# EAGLE design arpie_cv_tab (EAGLE 6.6.0)
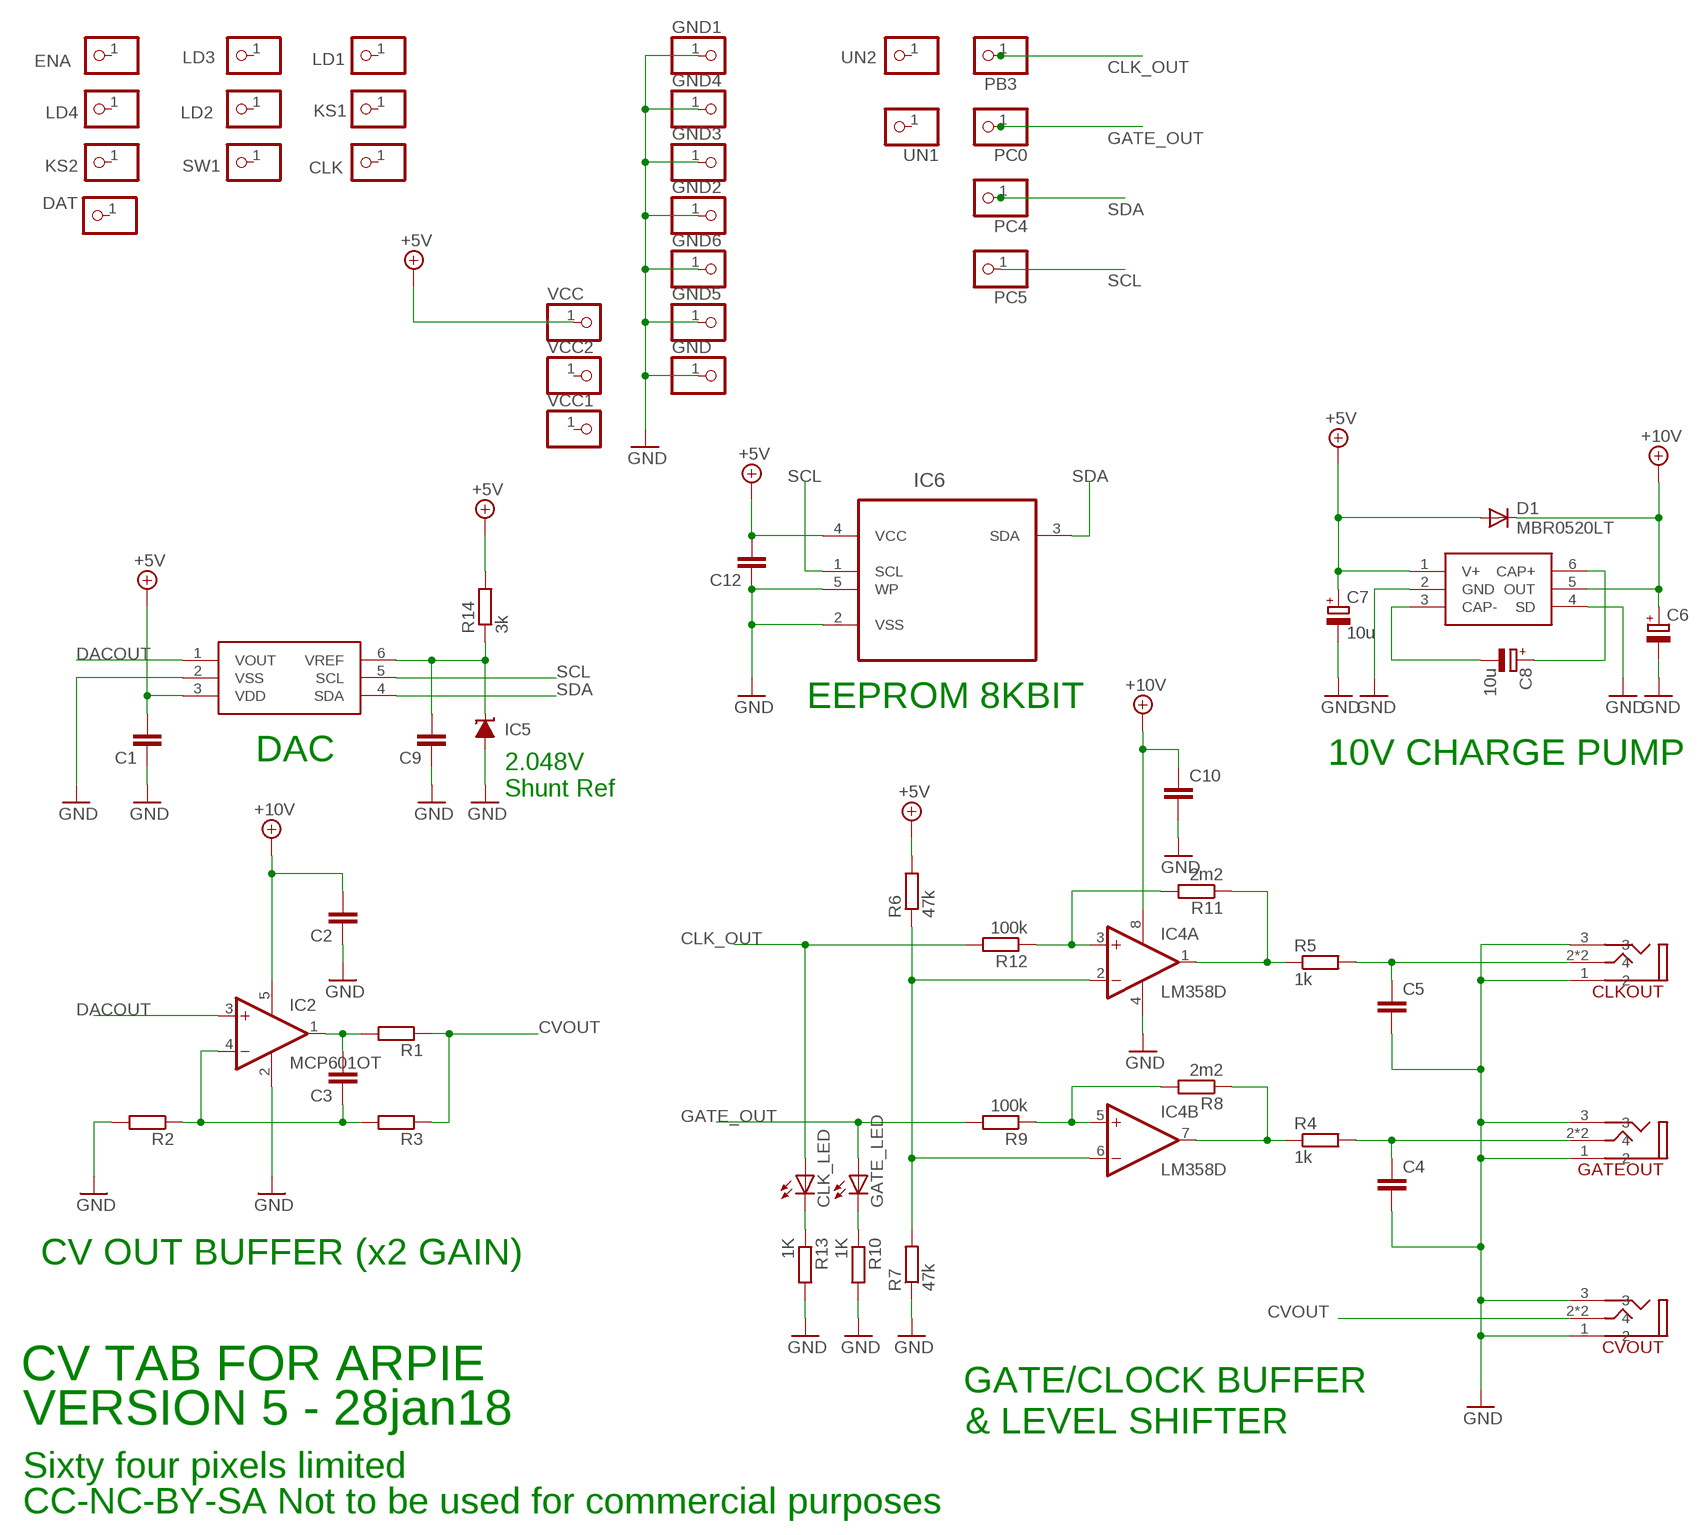
[diagram p0: schematic, sheet 1]

## Parts
C1  C-EUC0805  [C0805]
C2  C-EUC0805  [C0805]
C3  C-EUC0805  [C0805]
C4  C-EUC0805  [C0805]
C5  C-EUC0805  [C0805]
C6  CPOL-EUSMCA  [SMC_A]
C7  10u  CPOL-EUSMCA  [SMC_A]
C8  10u  CPOL-EUSMCA  [SMC_A]
C9  C-EUC0805  [C0805]
C10  C-EUC0805  [C0805]
C12  C-EUC0805  [C0805]
CLK  PINHD-1X1  [1X01]
CLK_LED  LEDCHIP-LED0805  [CHIP-LED0805]
CLKOUT  3_5MM_PTH_MICRO  [3_5MM_PTH_MICRO]
CVOUT  3_5MM_PTH_MICRO  [3_5MM_PTH_MICRO]
D1  MBR0520LT  [SOD123]
DAT  PINHD-1X1  [1X01]
ENA  PINHD-1X1  [1X01]
GATE_LED  LEDCHIP-LED0805  [CHIP-LED0805]
GATEOUT  3_5MM_PTH_MICRO  [3_5MM_PTH_MICRO]
GND  PINHD-1X1  [1X01]
GND1  PINHD-1X1  [1X01]
GND2  PINHD-1X1  [1X01]
GND3  PINHD-1X1  [1X01]
GND4  PINHD-1X1  [1X01]
GND5  PINHD-1X1  [1X01]
GND6  PINHD-1X1  [1X01]
IC1  MCP4726  [SOT23-6]
IC2  MCP601OT  [SOT23-5]
IC3  LM27675M5_CHARGEPUMP  [SOT23-6]
IC4  LM358D  [SO08]
IC5  LM4041A12DBZ  [DBZ_R-PDSO-G3]
IC6  24LC_16BT-I/OT  [SOT95P290X145-5N]
KS1  PINHD-1X1  [1X01]
KS2  PINHD-1X1  [1X01]
LD1  PINHD-1X1  [1X01]
LD2  PINHD-1X1  [1X01]
LD3  PINHD-1X1  [1X01]
LD4  PINHD-1X1  [1X01]
PB3  PINHD-1X1  [1X01]
PC0  PINHD-1X1  [1X01]
PC4  PINHD-1X1  [1X01]
PC5  PINHD-1X1  [1X01]
R1  R-EU_R0805  [R0805]
R2  R-EU_R0805  [R0805]
R3  R-EU_R0805  [R0805]
R4  1k  R-EU_R0805  [R0805]
R5  1k  R-EU_R0805  [R0805]
R6  47k  R-EU_R0805  [R0805]
R7  47k  R-EU_R0805  [R0805]
R8  2m2  R-EU_R0805  [R0805]
R9  100k  R-EU_R0805  [R0805]
R10  1K  R-EU_R0805  [R0805]
R11  2m2  R-EU_R0805  [R0805]
R12  100k  R-EU_R0805  [R0805]
R13  1K  R-EU_R0805  [R0805]
R14  3k  R-EU_R0805  [R0805]
SW1  PINHD-1X1  [1X01]
UN1  PINHD-1X1  [1X01]
UN2  PINHD-1X1  [1X01]
VCC  PINHD-1X1  [1X01]
VCC1  PINHD-1X1  [1X01]
VCC2  PINHD-1X1  [1X01]

## Nets
+5V: C1.2 C7.+ C12.2 D1.A IC1.3(VDD) IC3.1(V+) IC6.4(VCC) R6.2 R14.2 VCC.1
+10V: C2.2 C6.+ C10.1 D1.C IC2.5(V+) IC3.5(OUT) IC4.8(P:V+)
CLK_OUT: CLK_LED.A PB3.1 R12.2
CVOUT: CVOUT.2 CVOUT.2A R1.1 R3.1
DACOUT: IC1.1(VOUT) IC2.3(+IN)
GATE_OUT: GATE_LED.A PC0.1 R9.2
GND: C1.1 C2.1 C4.2 C5.2 C6.- C7.- C9.1 C10.2 C12.1 CLKOUT.1 CLKOUT.3 CVOUT.1 CVOUT.3 GATEOUT.1 GATEOUT.3 GND1.1 GND2.1 GND3.1 GND4.1 GND5.1 GND6.1 GND.1 IC1.2(VSS) IC2.2(V-) IC3.2(GND) IC3.4(SD) IC4.4(P:V-) IC5.2(A) IC6.2(VSS) IC6.5(WP) R2.2 R7.1 R10.2 R13.2
N$1: IC4.2(A:-IN) IC4.6(B:-IN) R6.1 R7.2
N$2: CLK_LED.C R13.1
N$3: GATE_LED.C R10.1
N$4: IC4.3(A:+IN) R11.2 R12.1
N$5: IC4.5(B:+IN) R8.2 R9.1
N$6: C9.2 IC1.6(VREF) IC5.1(C) R14.1
N$9: IC4.1(A:OUT) R5.1 R11.1
N$11: C3.2 IC2.1(OUT) R1.2
N$12: IC4.7(B:OUT) R4.1 R8.1
N$15: C3.1 IC2.4(-IN) R2.1 R3.2
N$19: C5.1 CLKOUT.2 CLKOUT.2A R5.2
N$20: C4.1 GATEOUT.2 GATEOUT.2A R4.2
N$38: C8.+ IC3.6(CAP+)
N$39: C8.- IC3.3(CAP-)
SCL: IC1.5(SCL) IC6.1(SCL) PC5.1
SDA: IC1.4(SDA) IC6.3(SDA) PC4.1
Unconnected: CLK.1 DAT.1 ENA.1 KS1.1 KS2.1 LD1.1 LD2.1 LD3.1 LD4.1 SW1.1 UN1.1 UN2.1 VCC1.1 VCC2.1

## Notes on the sheet
- EEPROM 8KBIT
- DAC | 10V CHARGE PUMP
- 2.048V 
  Shunt Ref
- CV OUT BUFFER (x2 GAIN)
- CV TAB FOR ARPIE
- GATE/CLOCK BUFFER
- VERSION 5 - 28jan18 | & LEVEL SHIFTER
- Sixty four pixels limited
- CC-NC-BY-SA Not to be used for commercial purposes

## Library data of the parts
C1-C5 C9 C10 C12 = resistor:C-EU: CAPACITOR, European symbol
C6-C8 = rcl:CPOL-EU: POLARIZED CAPACITOR, European symbol
CLK DAT ENA GND GND1-GND6 KS1 KS2 LD1-LD4 PB3 PC0 PC4 PC5 SW1 UN1 UN2 VCC VCC1 VCC2 = adafruit:PINHD-1X1: Pin header 1x1 for 0.1" spacing With round pins
CLK_LED GATE_LED = led:LED: LED OSRAM: - CHIPLED LG R971, LG N971, LY N971, LG Q971, LY Q971, LO R971, LY R971 LH N974, LH R974 LS Q976, LO Q976, LY Q976 LO Q996 - Hyper CHIPLED LW Q18S LB Q993, LB Q99A, LB R99A - SideLED LS A670, LO A670, LY A670, LG A670, LP A670 LB A673, LV A673, LT A673, LW A673 LH A674 LY A675 LS A676, LA A676, LO A676, LY A676, LW A676 LS A679, LY A679, LG A679 - Hyper Micro SIDELED® LS Y876, LA Y876, LO Y876, LY Y876 LT Y87S - SmartLED LW L88C, LW L88S LB L89C, LB L89S, LG L890 LS L89K, LO L89K, LY L89K LS L896, LA L896, LO L896, LY L896 - TOPLED LS T670, LO T670, LY T670, LG T670, LP T670 LSG T670, LSP T670, LSY T670, LOP T670, LYG T670 LG T671, LOG T671, LSG T671 LB T673, LV T673, LT T673, LW T673 LH T674 LS T676, LA T676, LO T676, LY T676, LB T676, LH T676, LSB T676, LW T676 LB T67C, LV T67C, LT T67C, LS T67K, LO T67K, LY T67K, LW E67C LS E67B, LA E67B, LO E67B, LY E67B, LB E67C, LV E67C, LT E67C LW T67C LS T679, LY T679, LG T679 LS T770, LO T770, LY T770, LG T770, LP T770 LB T773, LV T773, LT T773, LW T773 LH T774 LS E675, LA E675, LY E675, LS T675 LS T776, LA T776, LO T776, LY T776, LB T776 LHGB T686 LT T68C, LB T68C - Hyper Mini TOPLED® LB M676 - Mini TOPLED Santana® LG M470 LS M47K, LO M47K, LY M47K Source: http://www.osram.convergy.de LUXEON: - LUMILED® LXK2-PW12-R00, LXK2-PW12-S00, LXK2-PW14-U00, LXK2-PW14-V00 LXK2-PM12-R00, LXK2-PM12-S00, LXK2-PM14-U00 LXK2-PE12-Q00, LXK2-PE12-R00, LXK2-PE12-S00, LXK2-PE14-T00, LXK2-PE14-U00 LXK2-PB12-K00, LXK2-PB12-L00, LXK2-PB12-M00, LXK2-PB14-N00, LXK2-PB14-P00, LXK2-PB14-Q00 LXK2-PR12-L00, LXK2-PR12-M00, LXK2-PR14-Q00, LXK2-PR14-R00 LXK2-PD12-Q00, LXK2-PD12-R00, LXK2-PD12-S00 LXK2-PH12-R00, LXK2-PH12-S00 LXK2-PL12-P00, LXK2-PL12-Q00, LXK2-PL12-R00 Source: www.luxeon.com KINGBRIGHT: KA-3528ASYC Source: www.kingbright.com
CLKOUT CVOUT GATEOUT = jason_eagle6:3_5MM_PTH_MICRO
D1 = diode:MBR0520LT: SCHOTTKY BARRIER RECTIFIER Source: http://onsemi.com .. MBR0520LT1-D.pdf
IC1 = jasons_stuff:MCP4726: I2C DAC 12BIT
IC2 = linear:MCP601: Single Op Amp 2.7V to 6.0V Single Supply CMOS Source: http://ww1.microchip.com/downloads/en/DeviceDoc/21314g.pdf
IC3 = jason_eagle6:LM27675M5_CHARGEPUMP
IC4 = linear:LM358: OP AMP also LM158; LM258; LM2904 Source: http://cache.national.com/ds/LM/LM158.pdf
IC5 = texas:LM4041: PRECISION MICROPOWER SHUNT VOLTAGE REFERENCE Source: http://focus.ti.com/lit/ds/slcs146e/slcs146e.pdf; MPN: LM4041A12IDBZR; OC_FARNELL: 1407949; OC_NEWARK: 58K5875
IC6 = Microchip-24LCxxx:24LC_: IC, I2C Serial EEPROM,SOT-23-5; MPN: 24LC16BT-I/OT; OC_FARNELL: 9757961; OC_NEWARK: 62K0580; PACKAGE: SOT-23-5; SUPPLIER: MICROCHIP
R1-R14 = rcl:R-EU_: RESISTOR, European symbol

## Board
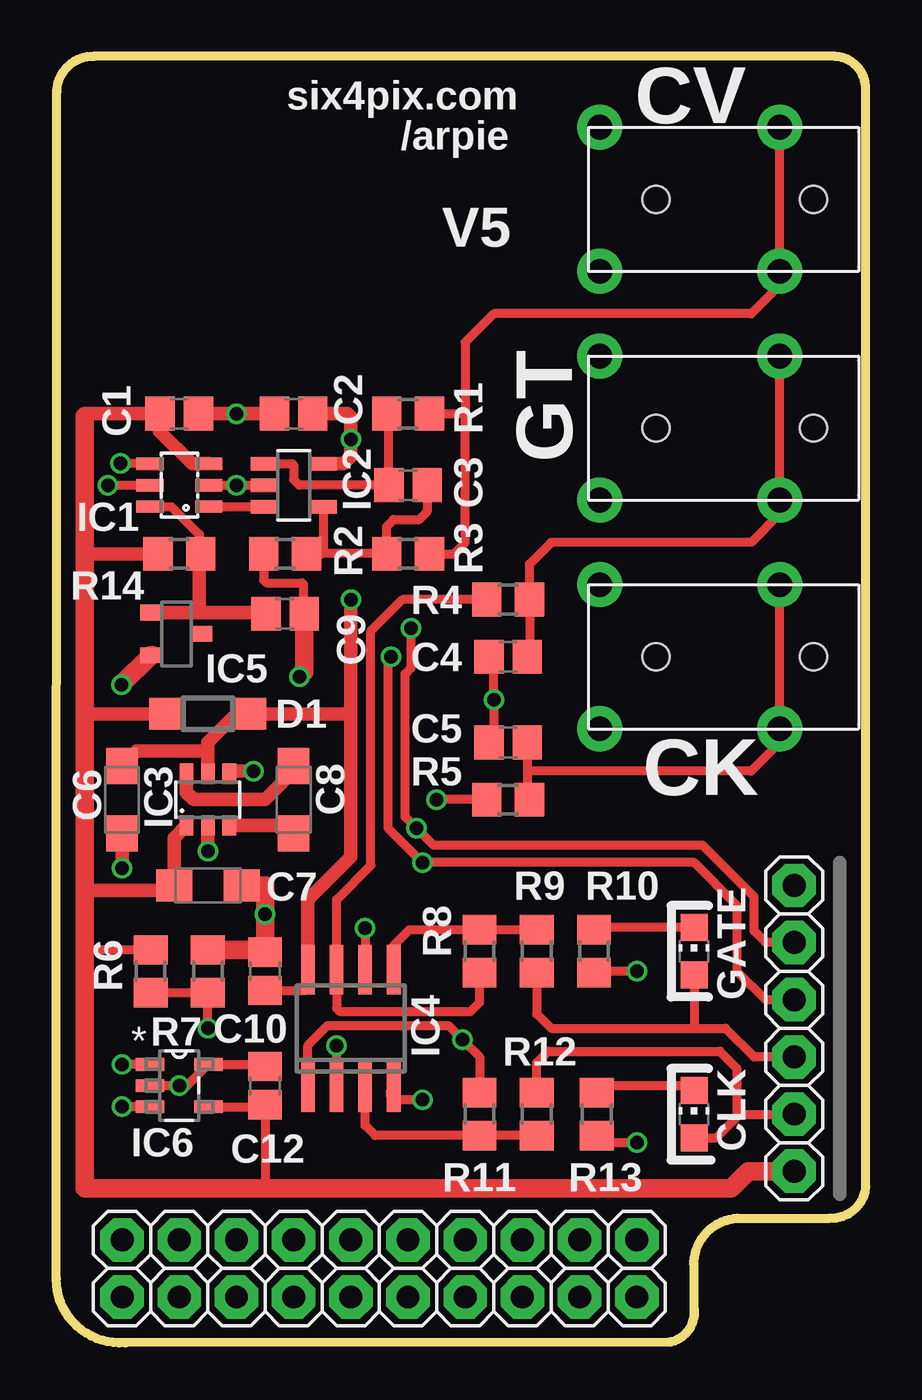
[diagram p1: board, top side]
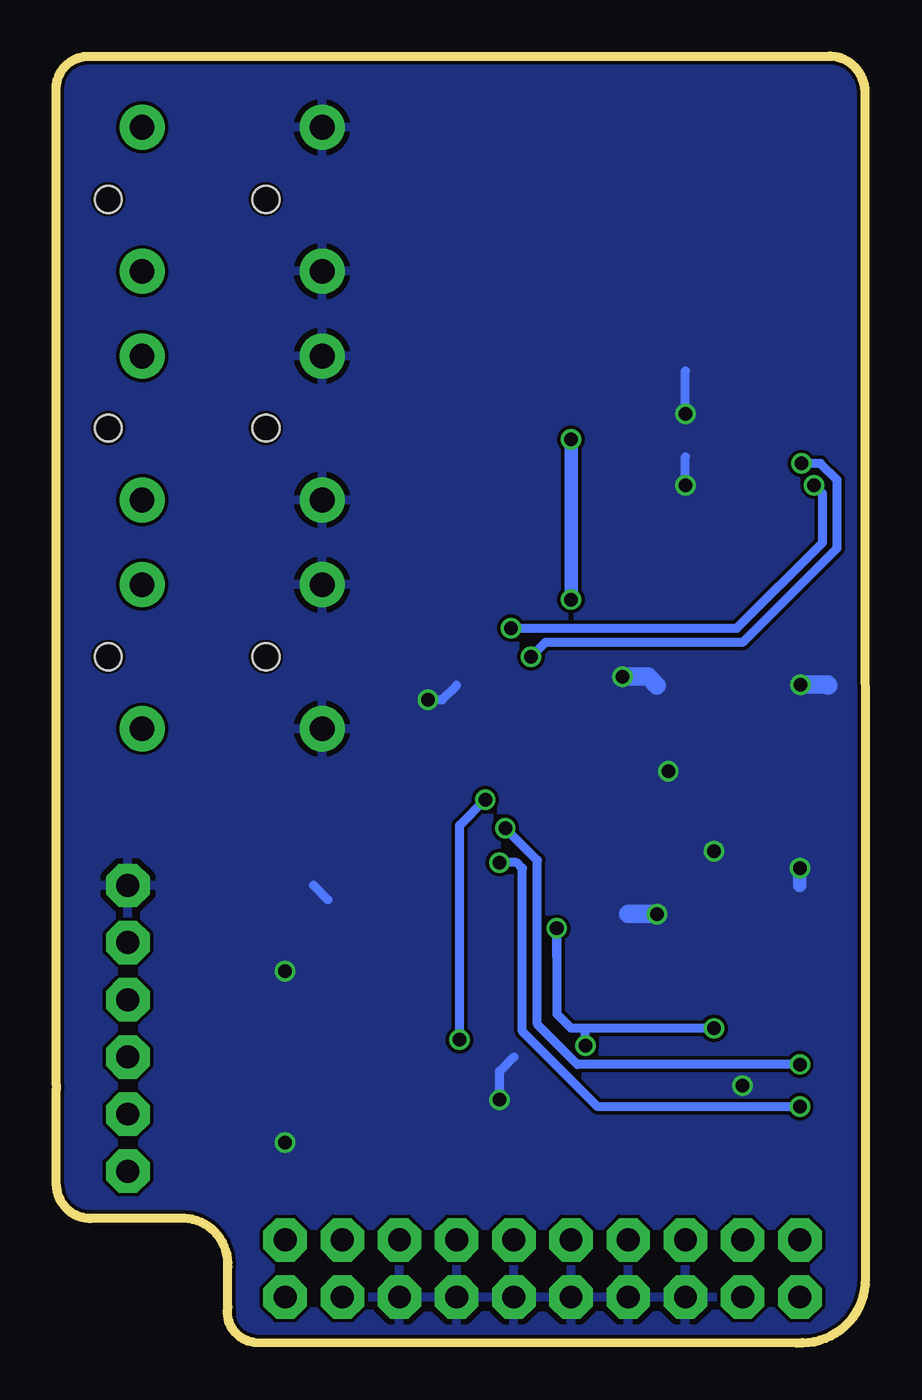
[diagram p2: board, bottom side, seen from below]

Size 35.94 x 57.17 mm. Coordinates in mm from the lower left corner, seen from the top.
Outline: 2.79,0.02 27.2,0.04 arc90 28.32,1.62 28.32,3.4 arc-90 30.25,5.55 34.37,5.55 arc90 35.94,7 35.94,11.32
Outline: 3.07,0 2.8,0.02 arc-90 0,2.86 0.02,55.62 arc-90 1.66,57.17
Outline: 35.94,55.88 arc81 34.6,57.17 1.65,57.17
Outline: 35.94,11.45 35.94,55.9
Copper layers (1*16): Top 0.035mm / dielectric 1.5mm / Bottom 0.035mm
Design rules "hackvana": minimum track width 6mil, minimum drill 0.3mm, track to track 6mil, track to pad 9mil, pad to pad 6mil, via to via 6mil, smd to smd 0mil, copper to edge 6mil, drill to drill 6mil, minimum pad ring 10mil, minimum via ring 6mil, stop-mask expansion 2mil, vias tented up to drill 100mil, thermal gap 10mil

### Footprints (pad centres in the part's own frame; a part is rotated, then mirrored left to right if it is on the bottom)
C0805 = smd 1.3 x 1.5: 1 -0.85,0; 2 0.85,0
SMC_A = smd 1.6 x 1.4: + -1.5,0; - 1.5,0
1X01 = drill 1.016 pad 1.93 octagon: 1 0,0
CHIP-LED0805 = smd 1.2 x 1.2: A 0,-1.05; C 0,1.05
3_5MM_PTH_MICRO = drill 1.1 pad 2: 1 3.2,-8; 2 -3.2,0; 2A 3.2,0; 3 -3.2,-8 | hole 1.2: 0,1.5; 0,-5.5
SOD123 = smd 1.4 x 1.4: A 1.9,0; C -1.9,0
SOT23-6 = smd 0.55 x 1.2: 1 -0.95,-1.3; 2 0,-1.3; 3 0.95,-1.3; 4 0.95,1.3; 5 0,1.3; 6 -0.95,1.3
SOT23-5 = smd 0.6 x 1.2: 1 -0.95,-1.306; 2 0,-1.306; 3 0.95,-1.306; 4 0.95,1.306; 5 -0.95,1.306
SOT23-6' = smd 0.6 x 0.9: 1 -0.95,-1.15; 2 0,-1.15; 3 0.95,-1.15; 4 0.95,1.15; 5 0,1.15; 6 -0.95,1.15
SO08 = smd 0.6 x 2.2: 1 -1.905,-2.6; 2 -0.635,-2.6; 3 0.635,-2.6; 4 1.905,-2.6; 5 1.905,2.6; 6 0.635,2.6; 7 -0.635,2.6; 8 -1.905,2.6
DBZ_R-PDSO-G3 = smd 0.7 x 1: 1 -0.95,-1.1; 2 0.95,-1.1; 3 0,1.1
SOT95P290X145-5N = smd 1.27 x 0.559: 1 -1.295,0.94; 2 -1.295,0; 3 -1.295,-0.94; 4 1.295,-0.94; 5 1.295,0.94
R0805 = smd 1.3 x 1.5: 1 -0.95,0; 2 0.95,0

### Placement (x,y rotation side)
C1  5.46,41.29 180 top
C2  10.54,41.29 0 top
C3  15.62,38.12 180 top
C4  20.07,30.5 180 top
C5  20.07,26.69 180 top
C6  2.92,24.15 270 top
C7  6.73,20.34 0 top
C8  10.54,24.15 270 top
C9  10.16,32.4 180 top
C10  9.27,16.53 90 top
C12  9.27,11.45 270 top
CLK  2.92,4.59 0 top
CLK_LED  28.32,10.18 0 top
CLKOUT  32.13,30.5 270 top
CVOUT  32.13,50.82 270 top
D1  6.73,27.96 180 top
DAT  5.46,4.59 0 top
ENA  20.7,4.59 90 top
GATE_LED  28.32,17.42 0 top
GATEOUT  32.13,40.66 270 top
GND  32.77,20.34 0 top
GND1  8,2.05 0 top
GND2  10.54,2.05 0 top
GND3  13.08,2.05 0 top
GND4  15.62,2.05 0 top
GND5  18.16,2.05 0 top
GND6  20.7,2.05 0 top
IC1  5.46,38.12 90 top
IC2  10.54,38.12 270 top
IC3  LM27675M5_CHARGEPUMP  [SOT23-6']  6.73,24.15 0 top
IC4  13.08,13.99 0 top
IC5  5.33,31.51 270 top
IC6  5.46,11.45 0 top
KS1  8,4.59 90 top
KS2  25.78,4.59 90 top
LD1  10.54,4.59 90 top
LD2  13.08,4.59 90 top
LD3  15.62,4.59 90 top
LD4  18.16,4.59 90 top
PB3  32.77,10.18 0 top
PC0  32.77,12.72 0 top
PC4  32.77,15.26 0 top
PC5  32.77,17.8 0 top
R1  15.62,41.29 180 top
R2  10.16,35.07 180 top
R3  15.62,35.07 180 top
R4  20.07,33.04 0 top
R5  20.07,24.15 0 top
R6  4.19,16.53 90 top
R7  6.73,16.53 270 top
R8  18.8,17.42 90 top
R9  21.34,17.42 270 top
R10  23.88,17.42 270 top
R11  18.8,10.18 270 top
R12  21.34,10.18 90 top
R13  24,10.18 270 top
R14  5.46,35.07 180 top
SW1  23.24,4.59 90 top
UN1  23.24,2.05 0 top
UN2  25.78,2.05 90 top
VCC  32.77,7.64 0 top
VCC1  2.92,2.05 0 top
VCC2  5.46,2.05 0 top

### Tracks (layer width: path | path; a pad name or v marks a point on that pad's centre or on a via)
+5V
  Top 0.406: R6.2 1.27,17.48 1.27,17.8 | IC6.4 9.27,10.51 C12.2 9.27,6.88
  Top 0.61: IC3.1 5.23,22.45 C7.+ 5.23,20.11 1.5,20.11 1.27,20.34 | D1.A 1.27,27.96 | 1.27,34.94 1.4,35.07 R14.2 4.57,35.13 | IC1.3 6.04,39.07 4.57,40.53 4.57,41.25 C1.2 1.37,41.29 1.27,41.19
  Top 0.813: VCC.1 30.73,7.64 29.97,6.88 9.27,6.88 1.27,6.88 1.27,17.8 1.27,20.34 1.27,27.96 1.27,34.94 1.27,41.19
+10V  (via drill 0.6)
  Top 0.406: C10.1 11.09,15.68 11.18,15.77 IC4.8
  Top 0.61: IC3.5 6.73,26.18 | 6.73,26.18 6.6,26.31 3.58,26.31 C6.+ | 6.73,26.18 6.73,26.69 8,27.96 D1.C 13.08,27.96 | 13.08,27.96 13.08,21.61 11.18,19.7 IC4.8 | 13.08,27.96 v13.08,33.04 | C2.2 12.95,41.29 13.08,41.17 13.08,40.66 v13.08,40.15 13.08,39.39 12.76,39.07 IC2.5
  Bottom 0.61: v13.08,33.04 v13.08,40.15
CLK_OUT
  Top 0.406: R12.2 21.34,12.46 21.84,12.97 29.46,12.97 30.23,12.21 30.23,10.18 30.35,10.18 | 30.35,10.18 PB3.1 | 30.35,10.18 29.3,9.13 CLK_LED.A
CVOUT
  Top 0.406: 18.16,41.29 18.16,35.58 17.65,35.07 R3.1 | R1.1 18.16,41.29 | 18.16,41.29 18.16,44.47 19.43,45.74 30.86,45.74 32.13,47.01 CVOUT.2A CVOUT.2
DACOUT
  Top 0.406: IC1.1 IC2.3
GATE_OUT
  Top 0.406: R9.2 21.34,14.62 21.97,13.99 28.32,13.99 | 28.32,13.99 29.72,13.99 30.99,12.72 PC0.1 | GATE_LED.A 28.32,13.99
GND  (via drill 0.6)
  Top 0.406: 24.19,9.23 R13.2 24.32,8.91 v25.78,8.91 | IC2.2 v8,38.12 IC1.2 | v16.26,10.81 14.99,10.81 14.86,10.94 14.86,11.26 IC4.4 | R2.2 9.21,33.91 9.35,33.77 10.92,33.77 10.97,33.72 10.97,32.44 C9.1 | C12.1 9.27,12.39 IC6.5 5.82,11.45 v5.46,11.45 IC6.2 | v25.78,16.53 23.94,16.53 R10.2 | C5.2 19.43,26.9 v19.43,28.59 19.43,30.28 C4.2
  Top 0.61: IC3.2 v6.73,21.86 | 8,20.34 C7.- | C6.- v2.92,21.1 | v8.76,25.42 7.8,25.42 IC3.4 | C2.1 v8,41.29 C1.1
  Top 0.813: R7.1 9.17,17.48 C10.2 v9.27,19.07 9.27,20.34 C7.- | IC5.2 4.21,30.56 v2.9,29.25 | C9.1 11.01,29.82 v10.79,29.61
  Bottom 0.406: v19.43,28.59 18.8,28.59 18.16,29.23 | 23.88,19.7 24.51,20.34 | v16.26,10.81 16.26,12.08 15.62,12.72 | v8,38.12 8,39.39 | v8,41.29 8,43.2
  Bottom 0.61: v2.92,21.1 2.92,20.34
  Bottom 0.813: v9.27,19.07 10.54,19.07 | v2.9,29.25 1.68,29.25 1.65,29.23 | v10.79,29.61 9.65,29.61 9.27,29.23
  pour Bottom: 0.38,57.17 0.38,0.02 35.43,0.02 35.43,57.17
N$1  (via drill 0.6)
  Top 0.406: v13.72,18.43 IC4.6 | R6.1 R7.2 v6.73,13.99 | IC4.2 v12.45,13.23
  Bottom 0.406: 13.72,17.16 v13.72,18.43 13.72,14.62 13.08,13.99 12.45,13.99 | v6.73,13.99 12.45,13.99 | v12.45,13.23 12.45,13.99
N$2
  Top 0.406: R13.1 24.32,11.45 28.1,11.45 CLK_LED.C
N$3
  Top 0.406: GATE_LED.C 23.98,18.47 R10.1
N$4
  Top 0.406: R12.1 R11.2 14.16,9.23 13.72,9.67 IC4.3
N$5
  Top 0.406: R9.1 R8.2 15.68,18.37 14.99,17.67 IC4.5
N$6
  Top 0.406: IC1.6 5.12,37.17 6.35,35.93 6.35,35.13 R14.1
  Top 0.61: IC5.1 6.22,32.46 | 6.22,32.46 9.25,32.46 C9.2 | 6.35,35.13 6.35,32.59 6.22,32.46
N$9  (via drill 0.6)
  Top 0.406: IC4.1 11.18,13.23 12.07,14.11 17.4,14.11 v18.03,13.48 18.8,12.72 R11.1 | R5.1 v16.89,24.15
  Bottom 0.406: v18.03,13.48 18.03,23 v16.89,24.15
N$11
  Top 0.406: IC2.1 10.48,39.07 10.54,39.01 10.54,38.37 10.79,38.12 C3.2 14.77,41.19 R1.2
N$12
  Top 0.406: R8.1 18.8,15.13 18.41,14.75 12.57,14.75 12.45,14.88 IC4.7 12.45,19.7 13.97,21.23 13.97,31.64 15.37,33.04 R4.1
N$15
  Top 0.406: IC2.4 11.85,35.11 | R2.1 11.81,35.07 11.85,35.11 | 11.85,35.11 14.63,35.11 R3.2 14.67,36.28 14.99,36.59 16.13,36.59 16.47,36.94 C3.1
N$19
  Top 0.406: C5.1 20.92,25.42 | 20.92,25.42 20.92,24.25 R5.2 | 20.92,25.42 30.86,25.42 32.13,26.69 CLKOUT.2A CLKOUT.2
N$20
  Top 0.406: C4.1 21.02,30.6 R4.2 21.02,34.62 21.97,35.58 30.86,35.58 32.13,36.85 GATEOUT.2A GATEOUT.2
N$38
  Top 0.61: C8.+ 10.54,25.42 9.27,24.15 6.1,24.15 5.78,24.46 IC3.6
N$39
  Top 0.61: IC3.3 10.19,23 C8.-
SCL  (via drill 0.6)
  Top 0.406: PC5.1 31.5,17.8 30.99,18.31 30.99,19.83 28.7,22.12 16.76,22.12 v16,22.88 15.49,23.39 15.49,29.74 15.75,29.99 v15.75,31.77 | v2.29,38.12 IC1.5 | IC6.1 v2.92,12.39
  Bottom 0.406: v2.29,38.12 1.91,37.74 1.91,35.58 5.71,31.77 v15.75,31.77 | v2.92,12.39 12.8,12.39 14.58,14.17 14.58,21.46 v16,22.88
SDA  (via drill 0.6)
  Top 0.406: PC4.1 31.5,15.26 30.23,16.53 30.23,19.45 28.32,21.35 v16.26,21.35 14.73,22.88 14.73,30.37 v14.86,30.5 | IC1.4 2.86,39.07 v2.84,39.08 | IC6.3 v2.92,10.51
  Bottom 0.406: v2.84,39.08 2.01,39.08 1.27,38.35 1.27,35.32 5.46,31.13 14.22,31.13 v14.86,30.5 | v2.92,10.51 11.89,10.51 15.24,13.86 15.24,21.1 15.49,21.35 v16.26,21.35

### Text on the board
tPlace: CV | V5 | GT | CK | GATE | CLK
tNames: six4pix.com | /arpie